# EAGLE design MainBoard 1.4.0 (EAGLE 9.5.0)
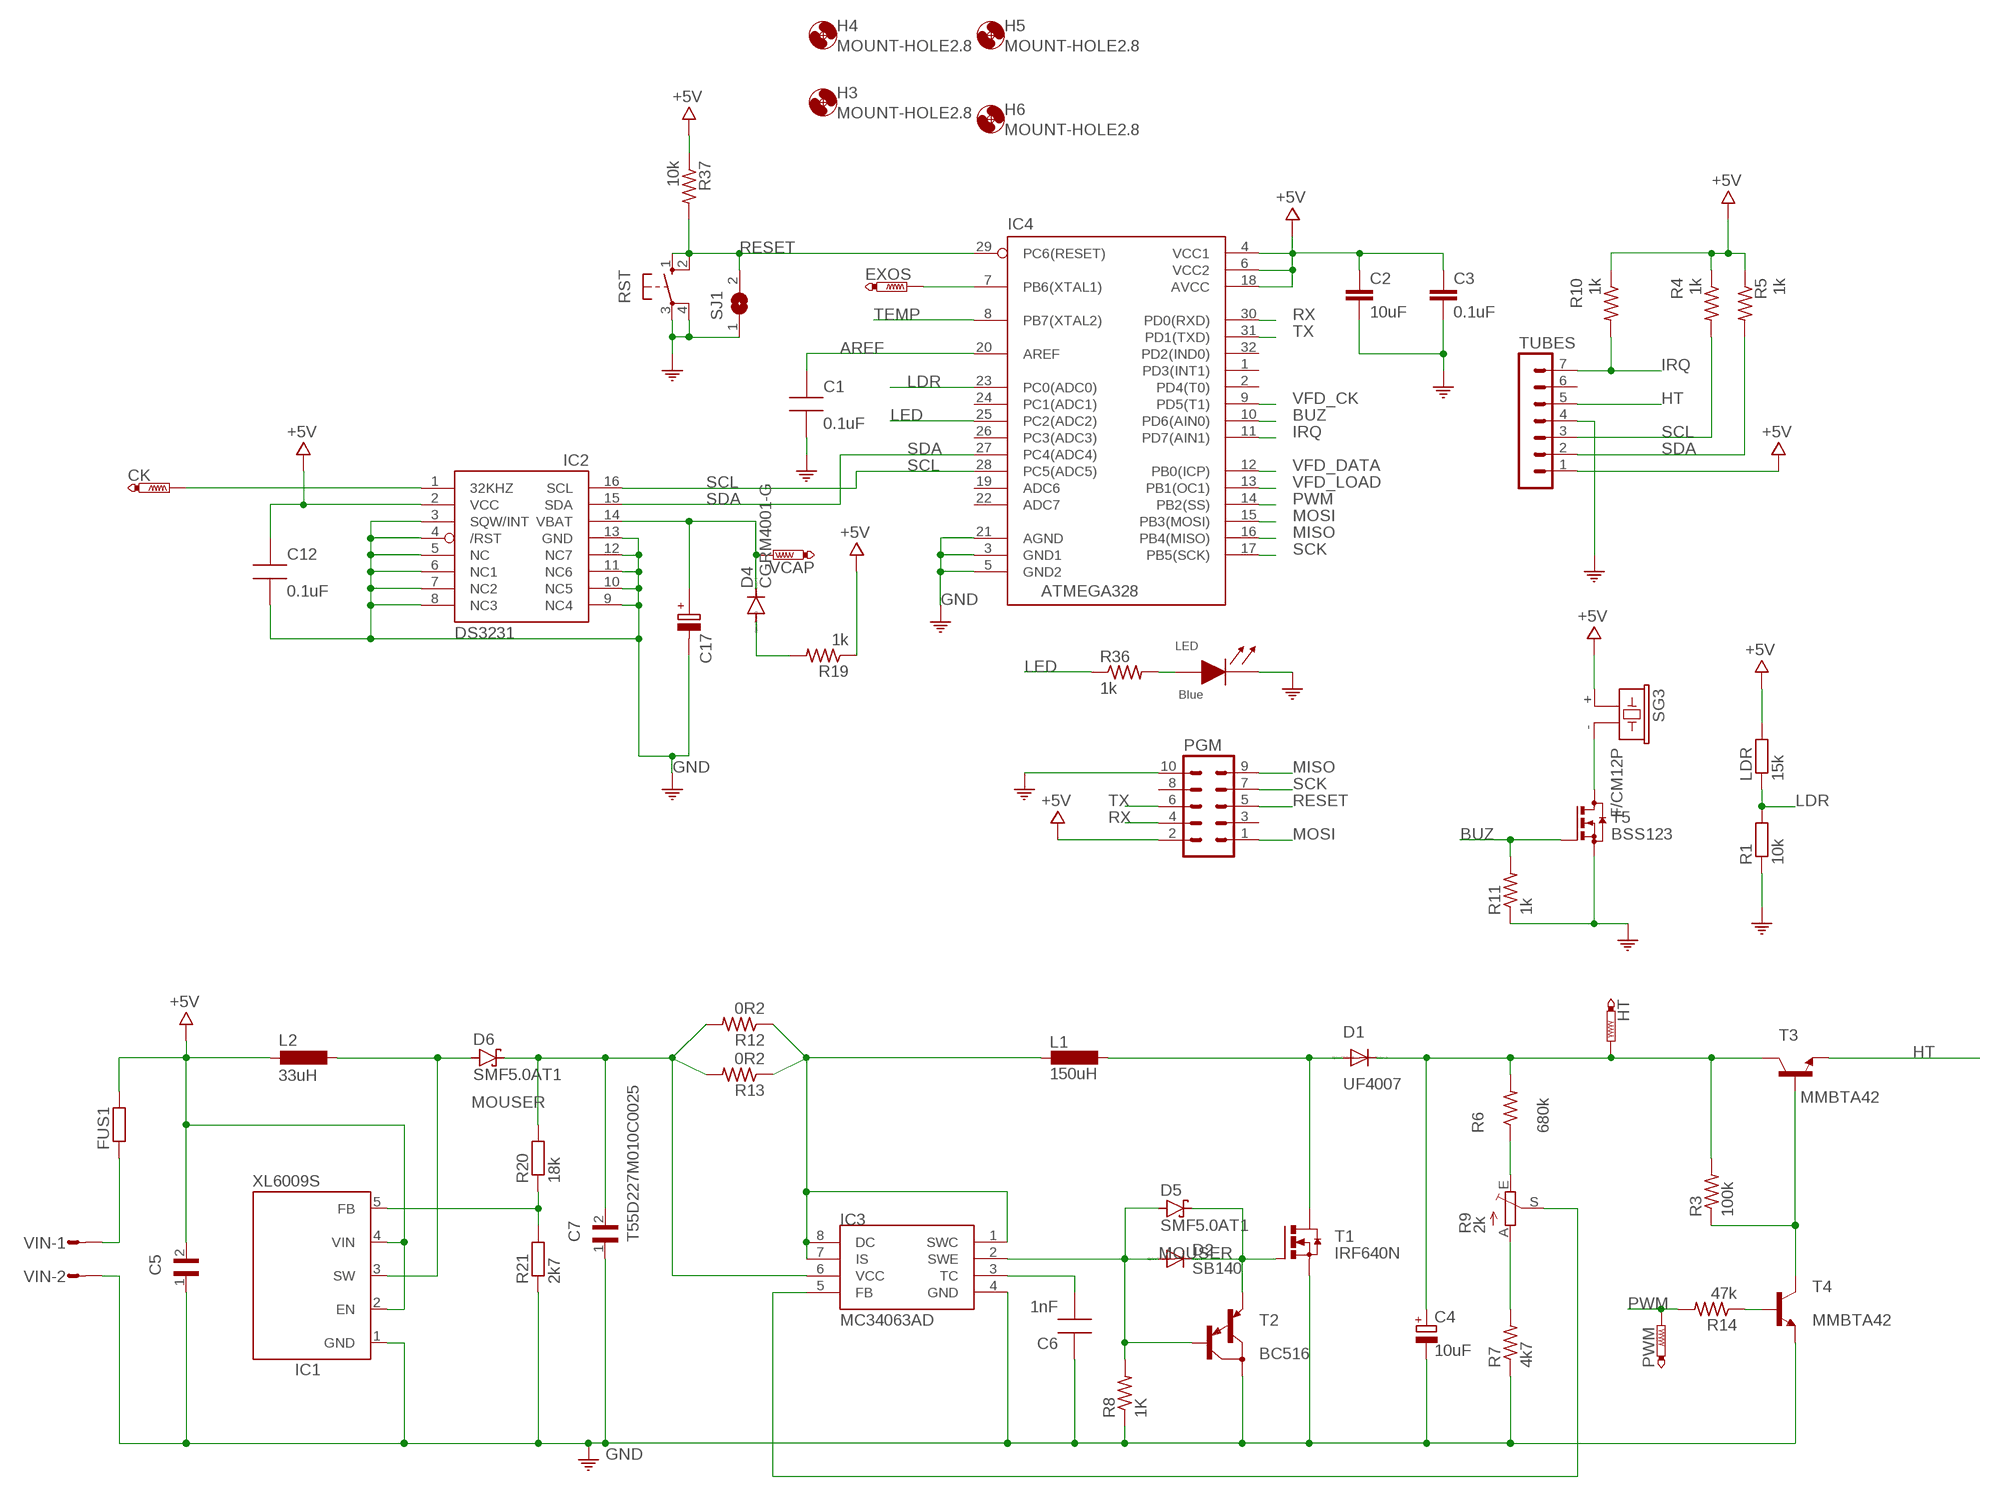
[diagram p0: schematic, sheet 1]

## Parts
C1  0.1uF  CAP0805-NP  [CAP0805-NP]
C2  10uF  C-EUC0603  [C0603]
C3  0.1uF  C-EUC0402K  [C0402K]
C4  10uF  CPOL-EUE3.5-10  [E3,5-10]
C5  T55D227M010C0025  [CAPPM7343X310N]
C6  1nF  CAP0805-NP  [CAP0805-NP]
C7  T55D227M010C0025  [CAPPM7343X310N]
C12  0.1uF  CAP0805-NP  [CAP0805-NP]
C17  AHG-35/100-RADIAL  [ELNA21.5X8.0]
CK  PTR1TP09R  [TP09R]
D1  UF4007  BYT01  [F126-10]
D2  SB140  DIODE-DO07  [DO07]
D4  CGRM4001-G  [SOD-123_MINI-SMA]
D5  SMF5.0AT1  [SOD123FL]
D6  SMF5.0AT1  [SOD123FL]
EXOS  PTR1TP09R  [TP09R]
FUS1  R-EU_R3225  [R3225]
H3  MOUNT-HOLE2.8  [2,8]
H4  MOUNT-HOLE2.8  [2,8]
H5  MOUNT-HOLE2.8  [2,8]
H6  MOUNT-HOLE2.8  [2,8]
HT  PTR1TP09R  [TP09R]
IC1  XL6009S  [TO263-5]
IC2  DS3231/SO  [SO16W]
IC3  MC34063AD  [SOIC8]
IC4  ATMEGA328  ATMEGA168-20AU  [QFP032]
L1  150uH  DO3316P  [DO3316P]
L2  33uH  MSS7341  [MSS7341]
LDR  15k  R-EU_0204/2V  [0204V]
LED  Blue  LED0805  [LED0805]
PGM  MA05-2  [MA05-2]
PWM  PTR1TP09R  [TP09R]
R1  10k  R-EU_M2012  [M2012]
R3  100k  R-US_R2012  [R2012]
R4  1k  R-US_M2012  [M2012]
R5  1k  R-US_M2012  [M2012]
R6  680k  R-US_R2012  [R2012]
R7  4k7  R-US_R2012  [R2012]
R8  1K  R-US_R2012  [R2012]
R9  2k  TRIM_EU-B25P  [B25P]
R10  1k  R-US_M2012  [M2012]
R11  1k  R-US_M2012  [M2012]
R12  0R2  R-US_R2010  [R2010]
R13  0R2  R-US_R2010  [R2010]
R14  47k  R-US_R2012  [R2012]
R19  1k  R-US_M2012  [M2012]
R20  18k  R-EU_R0805  [R0805]
R21  2k7  R-EU_R0805  [R0805]
R36  1k  R-US_M2012  [M2012]
R37  10k  R-US_M2012  [M2012]
RST  10-XX  [B3F-10XX]
SG3  F/CM12P  [F/CM12P]
SJ1  SJW  [SJW]
T1  IRF640N  IRF3704S  [D2PACK]
T2  BC516  [TO92]
T3  MMBTA42  BC846  [SOT23]
T4  MMBTA42  BC846  [SOT23]
T5  BSS123  [SOT23]
TUBES  MA07-1  [MA07-1]
VCAP  PTR1TP09R  [TP09R]
VIN  M02S  [02P]

## Nets
+5V [pwr]: C2.1 C3.1 C5.2 C12.1 FUS1.2 IC1.2(EN) IC1.4(VIN) IC2.2(VCC) IC4.4(VCC1) IC4.6(VCC2) IC4.18(AVCC) L2.1 LDR.2 PGM.2 R4.1 R5.1 R10.1 R19.1 R37.1 SG3.+ TUBES.1
AREF: C1.1 IC4.20(AREF)
BATT: C17.+ D4.C IC2.14(VBAT) VCAP.TP
BUZ: IC4.10(PD6(AIN0)) R11.2 T5.1(G)
GND: C1.2 C2.2 C3.2 C4.- C5.1 C6.1 C7.1 C12.2 C17.- IC1.1(GND) IC2.3(SQW/INT) IC2.4(/RST) IC2.5(NC) IC2.6(NC1) IC2.7(NC2) IC2.8(NC3) IC2.9(NC4) IC2.10(NC5) IC2.11(NC6) IC2.12(NC7) IC2.13(GND) IC3.4(GND) IC4.3(GND1) IC4.5(GND2) IC4.21(AGND) LED.1(CA) PGM.10 R1.1 R7.1 R8.1 R11.1 R21.1 RST.3(P) RST.4(P1) SJ1.1 T1.3(S) T2.3(C) T4.2(E) T5.2(S) TUBES.4 VIN.2 ; supply symbol labelled COM
HT: T3.2(E) TUBES.5
IRQ: IC4.11(PD7(AIN1)) R10.2 TUBES.7
LDR: IC4.23(PC0(ADC0)) LDR.1 R1.2
LED: IC4.25(PC2(ADC2)) R36.1
MISO: IC4.16(PB4(MISO)) PGM.9
MOSI: IC4.15(PB3(MOSI)) PGM.1
N$1: CK.TP IC2.1(32KHZ)
N$2: D1.A L1.2 T1.2(D)
N$3: SG3.- T5.3(D)
N$5: EXOS.TP IC4.7(PB6(XTAL1))
N$6: C6.2 IC3.3(TC)
N$7: R3.1 T3.1(B) T4.3(C)
N$8: IC1.5(FB) R20.1 R21.2
N$9: R7.2 R9.A
N$10: D2.A D5.A IC3.2(SWE) R8.2 T2.2(B)
N$11: R6.1 R9.E
N$14 [pwr]: FUS1.1 VIN.1
N$15: LED.2(AN) R36.2
N$16: IC3.5(FB) R9.S
N$17: IC3.1(SWC) IC3.7(IS) IC3.8(DC) L1.1 R12.1 R13.1
N$19: R14.1 T4.1(B)
N$21: D2.C D5.C T1.1(G) T2.1(E)
N$23: D4.A R19.2
N$25: D6.A IC1.3(SW) L2.2
PWM: IC4.14(PB2(SS)) PWM.TP R14.2
PWR [pwr]: C7.2 D6.C IC3.6(VCC) R12.2 R13.2 R20.2
RAW_HT: C4.+ D1.C HT.TP R3.2 R6.2 T3.3(C)
RESET: IC4.29(PC6(RESET)) PGM.5 R37.2 RST.1(S) RST.2(S1) SJ1.2
RX: IC4.30(PD0(RXD)) PGM.4
SCK: IC4.17(PB5(SCK)) PGM.7
SCL: IC2.16(SCL) IC4.28(PC5(ADC5)) R4.2 TUBES.3
SDA: IC2.15(SDA) IC4.27(PC4(ADC4)) R5.2 TUBES.2
TEMP: IC4.8(PB7(XTAL2))
TX: IC4.31(PD1(TXD)) PGM.6
VFD_CK: IC4.9(PD5(T1))
VFD_DATA: IC4.12(PB0(ICP))
VFD_LOAD: IC4.13(PB1(OC1))
Unconnected: IC4.1(PD3(INT1)) IC4.2(PD4(T0)) IC4.19(ADC6) IC4.22(ADC7) IC4.24(PC1(ADC1)) IC4.26(PC3(ADC3)) IC4.32(PD2(IND0)) PGM.3 PGM.8 TUBES.6

## Library data of the parts
C1 C6 C12 = MySMD:CAP0805-NP
C2 = rcl:C-EU: CAPACITOR, European symbol; MOUSER: 791-0603X106K100CT; SPICEPREFIX: C
C3 = rcl:C-EU: CAPACITOR, European symbol; MOUSER: 963-JMK042BJ104KC-W; SPICEPREFIX: C
C4 = resistor:CPOL-EU: POLARIZED CAPACITOR, European symbol
C5 = T55D227M010C0025:T55D227M010C0025: Cap Tant Polymer 220uF 10VDC D CASE 20% (7.3 X 4.3 X 2.8mm) SMD 7343-30 0.025 Ohm 105C T/R; DESCRIPTION: T55D227M010C0025; DIGI-KEY_PART_NUMBER: 718-2103-1-ND; DIGI-KEY_PURCHASE_URL: https://www.digikey.com/product-detail/en/vishay-sprague/T55D227M010C0025/718-2103-1-ND/5287349?utm_source=snapeda&utm_medium=aggregator&utm_campaign=symbol; MF: Vishay; MOUSER: T55D227M010C0025; MP: T55D227M010C0025; PACKAGE: 2917 Vishay
C7 = T55D227M010C0025:T55D227M010C0025: Cap Tant Polymer 220uF 10VDC D CASE 20% (7.3 X 4.3 X 2.8mm) SMD 7343-30 0.025 Ohm 105C T/R; DESCRIPTION: T55D227M010C0025; DIGI-KEY_PART_NUMBER: 718-2103-1-ND; DIGI-KEY_PURCHASE_URL: https://www.digikey.com/product-detail/en/vishay-sprague/T55D227M010C0025/718-2103-1-ND/5287349?utm_source=snapeda&utm_medium=aggregator&utm_campaign=symbol; MF: Vishay; MP: T55D227M010C0025; PACKAGE: 2917 Vishay
C17 = Elkos:AHG-35/100-RADIAL: AUDYN® - AHG Gepolt, radial High Grade AHG Gepolter Elekrolytkondensator für Audio-Netzteile, oder Verstärker im Home- und Car-Bereich. Technische Daten Anschlußdrähte: Kupfer, verzinnt AL: ? mm d2ø : ? mm Kapazitätsbereich: von 10 µF bis 2200 µF Nennspannungen: 25 V, 35 V, 50 V, 100 V C-Toleranz: 20 % ( bei 20° C ) Verlustfaktor: tan δ < 0,100 @ 1 kHz Temperaturbereich: - 40° C bis 85° C Verzerrung: sehr gering bei 10 kHz, 010 A - 120 dB oder niedriger gepolt AHG AUDYN® - AHG gepolt Bezeichnung C U DxH Rm Bestell.-Nr. U / Volt D x L/mm mm AHG/10.0/100V 10µF 100V 10x15 5,0 1341690 AHG/22.0/50V 22µF 50V 10x13 5,0 1341691 AHG/47.0/50V 47µF 50V 10x16 5,0 1341692 AHG/100.0/50V 100µF 50V 13x21 5,0 1341693 AHG/220.0/50V 220µF 50V 16x25 7,5 1341694 AHG/470.0/50V 470µF 50V 16x37 7,5 1341695 AHG/1000/35V 1000µF 35V 18x37 7,5 1341696 AHG/2200/35V 2200µF 35V 22x38 10,0 1341697 Alle Abmessungen in mm; MOUSER: 555-DB-5R5D474T
CK EXOS HT PWM VCAP = testpad:PTR1: TEST PIN
D1 = diode:BYT01: DIODE ultra fast
D2 = diode:DIODE-: DIODE
D4 = diode:CGRM400*-G: Molded plasitc,JEDEC SOD-123/Mini SMA Source: Comchip CGRM4001-G.pdf; MOUSER: 863-NSR0320MW2T1G
D5 D6 = diode:SMF5.0AT1: 200 W Transient Voltage Suppressor Source: Data sheet <http://www.onsemi.com/pub_link/Collateral/SMF5.0AT1-D.PDF>; MOUSER: 863-MBR0520LT1G
FUS1 = rcl:R-EU_: RESISTOR, European symbol; MOUSER: 530-0ZCG0150AF2C; SPICEPREFIX: R
H3-H6 = holes:MOUNT-HOLE: MOUNTING HOLE with drill center marker
IC1 = XL6009-TO263:XL6009: XL6009. 400KHz 60V 4A Switching Current Boost / Buck-Boost / Inverting DC/DC Converter. Created By: Manash Jyoti Deka. Github: https://github.com/mjdeka
IC2 = DS3231:DS3231: The DS3231 is a low-cost, extremely accurate I²C real-time clock (RTC) with an integrated temperature-compensated crystal oscillator (TCXO) and crystal. The device incorporates a battery input, and maintains accurate timekeeping when main power to the device is interrupted.; AVAILABILITY: Unavailable; MF: Maxim Integrated; MP: DS3231; PACKAGE: SOIC-16 Maxim Integrated; PRICE: None
IC3 = mc34063:MC34063
IC4 = MySMD:ATMEGA168-20AU
L1 = STEAM-inductor-coilcraft:DO3316P: COILCRAFT; OC_FARNELL: unknown; OC_NEWARK: unknown
L2 = STEAM-inductor-coilcraft:MSS7341: Shielded Power Inductors Package 6.6 × 6.6 mm x 4.1 mm high Source: http://www.farnell.com/datasheets/1681958.pdf; MOUSER: 710-784770330
LDR R1 R20 R21 = resistor:R-EU_: RESISTOR, European symbol
LED = MySMD:LED0805
PGM = con-lstb:MA05-2: PIN HEADER; OC_FARNELL: unknown; OC_NEWARK: unknown
R3-R8 R10-R14 R19 R36 R37 = adafruit:R-US_: RESISTOR, American symbol
R9 = pot:TRIM_EU-: POTENTIOMETER
RST = switch-omron:10-XX: OMRON SWITCH; MPN: B3F-1000; OC_FARNELL: 176432; OC_NEWARK: 36M3542
SG3 = buzzer:F/CM12P: BUZZER Source: Buerklin; OC_FARNELL: unknown; OC_NEWARK: unknown
SJ1 = jumper:SJ: SMD solder JUMPER
T1 = transistor-power:IRF3704: SMPS MOSFET HEXFET® Power MOSFET Source: http://www.irf.com/product-info/datasheets/data/irf3704.pdf
T2 = transistor-pnp:BC516: PNP Darlington Transistor
T3 T4 = transistor:BC846: NPN TRANSISTOR
T5 = transistor-small-signal:BSS123: N-CHANNEL MOS FET
TUBES = con-lstb:MA07-1: PIN HEADER; OC_FARNELL: unknown; OC_NEWARK: unknown
VIN = con-amp-quick:M02S: AMP QUICK CONNECTOR; OC_FARNELL: unknown; OC_NEWARK: unknown

## Module TUBEIN16
Ports: 

### Library data of the parts

## Net classes
0 default: width 0.254 mm, clearance 0.254 mm
1 pwr: width 0.254 mm, clearance 0.356 mm

## Board
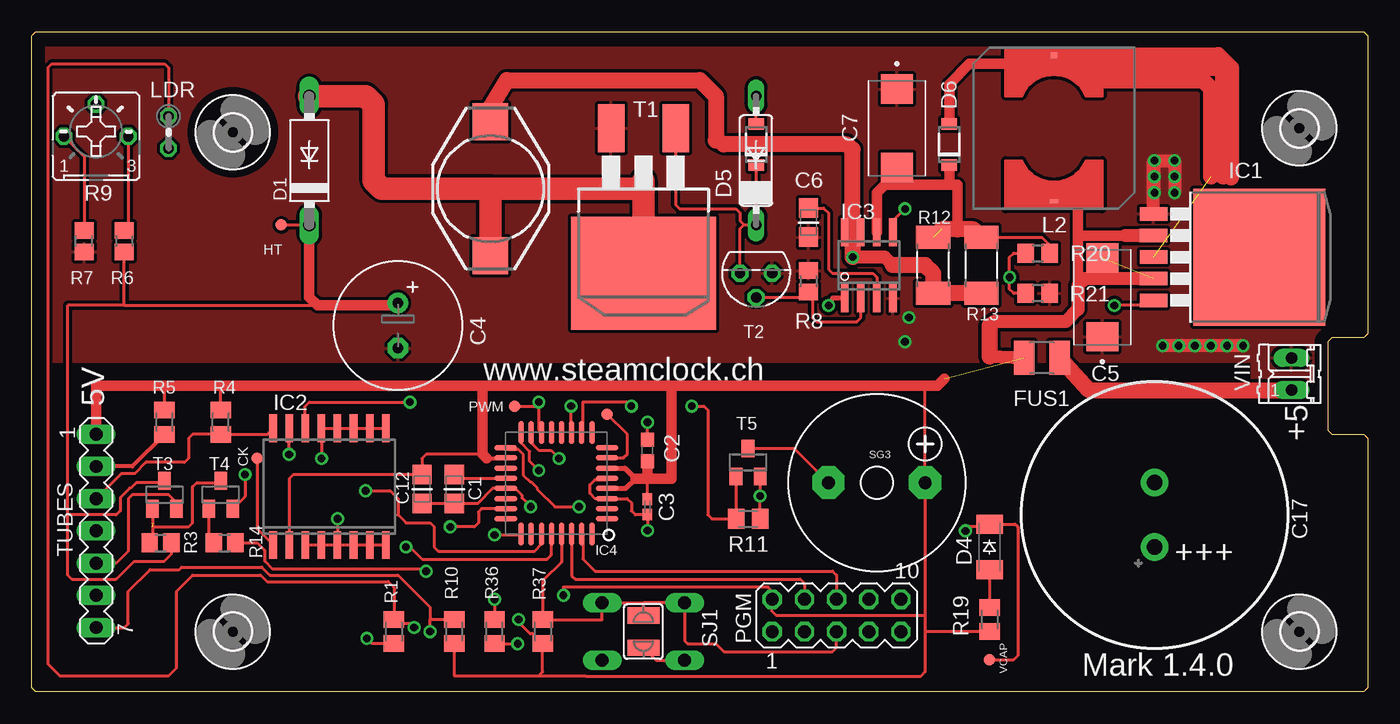
[diagram p1: board, top side]
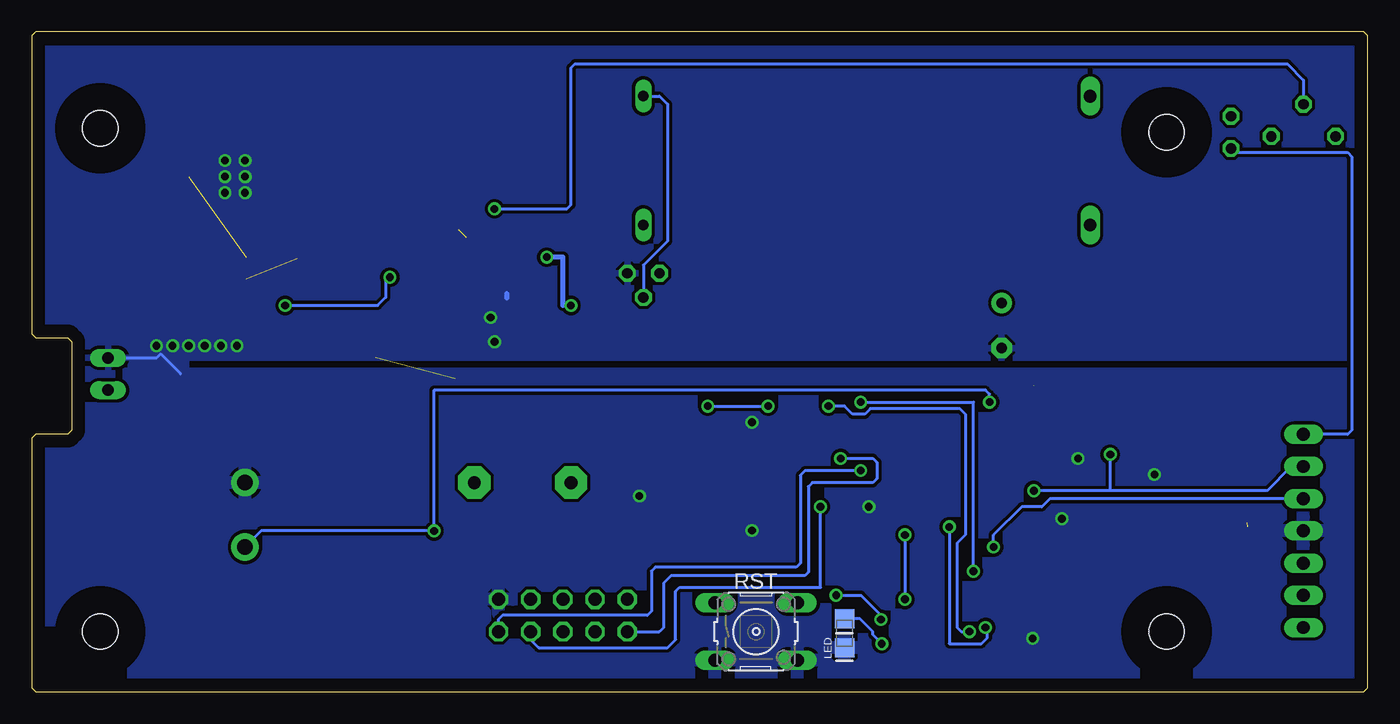
[diagram p2: board, bottom side, seen from below]

Size 105.41 x 52.07 mm. Coordinates in mm from the lower left corner, seen from the top.
Outline: 0.32,52.07 105.09,52.07 105.41,51.75 105.41,28.26 105.09,27.94 102.55,27.94 102.23,27.62 102.23,20.64 102.55,20.32 105.09,20.32 105.41,20 105.41,0.32 105.09,0 0.32,0 0,0.32 0,51.75 0.32,52.07
Copper layers (1*16): Top 0.035mm / dielectric 1.5mm / Bottom 0.035mm
Design rules "default": minimum track width 10mil, minimum drill 24mil, track to track 8mil, track to pad 8mil, pad to pad 8mil, via to via 8mil, smd to smd 8mil, copper to edge 40mil, drill to drill 8mil, minimum pad ring 10mil, minimum via ring 8mil, stop-mask expansion 4mil, vias tented up to drill 0mil, thermal gap 10mil

### Footprints (pad centres in the part's own frame; a part is rotated, then mirrored left to right if it is on the bottom)
CAP0805-NP = smd 1.524 x 1.524: 1 0,0; 2 2.286,0
C0603 = smd 1.1 x 1: 1 -0.85,0; 2 0.85,0
C0402K = smd 0.925 x 0.74: 1 -0.6,0; 2 0.6,0
E3,5-10 = drill 0.813 pad 1.6: + -1.778,0 | drill 0.813 pad 1.6 octagon: - 1.778,0
CAPPM7343X310N = smd 2.31 x 2.52: 1 -3.1,0; 2 3.1,0
ELNA21.5X8.0 = drill 1.2 pad 2.184: + -2.54,0; - 2.54,0
TP09R = smd 0.9 x 0.9: TP 0,0
F126-10 = drill 1.016 long: A 5.08,0; C -5.08,0
DO07 = drill 0.813 long: A 5.08,0; C -5.08,0
SOD-123_MINI-SMA = smd 1.5 x 2.1: A 1.8,0; C -1.8,0
SOD123FL = smd 0.91 x 1.22: A 1.625,0; C -1.625,0
R3225 = smd 1.6 x 2.7: 1 -1.4,0; 2 1.4,0
2,8 = hole 2.8: 0,0
TO263-5 = smd 1.067 x 2.159: 1 -3.404,-5.791; 2 -1.702,-5.791; 3 0,-5.791; 4 1.702,-5.791; 5 3.404,-5.791 | smd 10.8 x 10.41: 6 0,2.54
SO16W = smd 0.6 x 2.2: 1 -4.445,-4.6; 2 -3.175,-4.6; 3 -1.905,-4.6; 4 -0.635,-4.6; 5 0.635,-4.6; 6 1.905,-4.6; 7 3.175,-4.6; 8 4.445,-4.6; 9 4.445,4.6; 10 3.175,4.6; 11 1.905,4.6; 12 0.635,4.6; 13 -0.635,4.6; 14 -1.905,4.6; 15 -3.175,4.6; 16 -4.445,4.6
SOIC8 = smd 0.6 x 2.2: 1 -1.905,-2.6; 2 -0.635,-2.6; 3 0.635,-2.6; 4 1.905,-2.6; 5 1.905,2.6; 6 0.635,2.6; 7 -0.635,2.6; 8 -1.905,2.6
QFP032 = smd 0.432 x 1.778: 1 0,0; 2 0.8,0; 3 1.599,0; 4 2.399,0; 5 3.199,0; 6 3.998,0; 7 4.798,0; 8 5.598,0; 17 5.588,8.001; 18 4.798,7.997; 19 3.998,7.997; 20 3.199,7.997; 21 2.399,7.997; 22 1.599,7.997; 23 0.799,7.997; 24 0,7.997 | smd 1.778 x 0.432: 9 6.807,1.194; 10 6.807,2.007; 11 6.807,2.794; 12 6.807,3.607; 13 6.807,4.394; 14 6.807,5.182; 15 6.807,5.994; 16 6.816,6.803; 25 -1.194,6.807; 26 -1.194,5.994; 27 -1.194,5.182; 28 -1.194,4.394; 29 -1.194,3.607; 30 -1.194,2.794; 31 -1.194,2.007; 32 -1.194,1.194
DO3316P = smd 2.92 x 2.79: 1 -5.28,0; 2 5.28,0
MSS7341 = smd 0.61 x 0.305: 1 0,5.765 | smd 0.5 x 0.5: 2 0,-5.765
0204V = drill 0.813 octagon: 1 -1.27,0; 2 1.27,0
LED0805 = smd 1.524 x 1.524: 1 0,0; 2 2.286,0
MA05-2 = drill 1.016 octagon: 1 -5.08,-1.27; 2 -5.08,1.27; 3 -2.54,-1.27; 4 -2.54,1.27; 5 0,-1.27; 6 0,1.27; 7 2.54,-1.27; 8 2.54,1.27; 9 5.08,-1.27; 10 5.08,1.27
M2012 = smd 1.3 x 1.6: 1 -0.95,0; 2 0.95,0
R2012 = smd 1.3 x 1.5: 1 -0.85,0; 2 0.85,0
B25P = drill 0.813 octagon: A -2.54,0; E 2.54,0; S 0,2.54
R2010 = smd 1.8 x 2.7: 1 -2.2,0; 2 2.2,0
R0805 = smd 1.3 x 1.5: 1 -0.95,0; 2 0.95,0
B3F-10XX = drill 1.016 long: 1 -3.251,2.261; 2 3.251,2.261; 3 -3.251,-2.261; 4 3.251,-2.261
F/CM12P = drill 1.016 pad 2.54 octagon: + 3.81,0; - -3.81,0
SJW = smd 1.27 x 2.54: 1 -1.27,0; 2 1.27,0
D2PACK = smd 2.083 x 3.81: 1 -2.54,-8.89; 3 2.54,-8.89 | smd 11.43 x 8.89: 2 0,2.54
TO92 = drill 0.813 octagon: 1 1.27,0; 2 0,1.905; 3 -1.27,0
SOT23 = smd 1 x 1.4: 1 -0.95,-1.1; 2 0.95,-1.1; 3 0,1.1
MA07-1 = drill 1.016 long: 1 -7.62,0; 2 -5.08,0; 3 -2.54,0; 4 0,0; 5 2.54,0; 6 5.08,0; 7 7.62,0
02P = drill 0.914 long: 1 -1.27,0; 2 1.27,0

### Placement (x,y rotation side)
C1  33.34,17.15 270 top
C2  48.58,19.05 90 top
C3  48.58,14.6 270 top
C4  28.89,28.89 270 top
C5  84.45,31.12 90 top
C6  61.28,35.88 90 top
C7  68.26,44.45 270 top
C12  30.8,17.15 270 top
C17  88.58,13.97 90 top
CK  17.78,18.41 180 top
D1  21.91,41.91 90 top
D2  57.15,41.91 90 top
D4  75.56,11.43 270 top
D5  57.15,43.18 90 top
D6  72.39,43.18 90 top
EXOS  45.4,21.91 0 top
FUS1  79.69,26.35 180 top
H3  15.88,44.13 0 top
H4  15.88,4.76 0 top
H5  100.01,4.76 0 top
H6  100.01,44.45 0 top
HT  19.68,36.83 0 top
IC1  94.3,34.29 270 top
IC2  23.5,16.19 0 top
IC3  66.04,33.66 0 top
IC4  45.4,13.65 90 top
L1  36.2,39.69 270 top
L2  80.64,44.45 180 top
LDR  10.79,44.13 270 top
LED  41.27,3.49 90 bottom
PGM  63.5,6.03 0 top
PWM  38.1,22.54 0 top
R1  28.57,4.76 90 top
R3  10.16,11.75 0 top
R4  14.92,21.27 270 top
R5  10.48,21.27 270 top
R6  7.3,35.56 270 top
R7  4.13,35.56 90 top
R8  61.28,32.38 270 top
R9  5.08,43.81 0 top
R10  33.34,4.76 90 top
R11  56.52,13.65 180 top
R12  71.12,33.66 90 top
R13  74.93,33.66 90 top
R14  15.24,11.75 0 top
R19  75.56,5.71 90 top
R20  79.38,34.61 0 top
R21  79.38,31.43 180 top
R36  36.51,4.76 270 top
R37  40.32,4.76 90 top
RST  48.26,4.76 0 bottom
SG3  66.67,16.51 0 top
SJ1  48.26,4.76 90 top
T1  48.26,35.56 180 top
T2  57.15,33.02 180 top
T3  10.48,15.56 0 top
T4  14.92,15.56 0 top
T5  56.52,18.1 0 top
TUBES  5.08,12.7 270 top
VCAP  75.56,2.54 0 top
VIN  99.38,25.08 90 top

### Tracks (layer width: path | path; a pad name or v marks a point on that pad's centre or on a via)
+5V  (via drill 0.61)  (3 unrouted)
  Top 0.254: 37.37,18.41 IC4.18 | 40.01,1.27 40.32,1.59 R37.1 39.55,4.58 39.32,4.58 38.42,5.49 v38.42,5.71 | R5.1 10.48,24.13 | R4.1 14.92,24.13 | 40.01,1.27 33.34,1.27 R10.1 | R19.1 75.25,5.08 | 70.48,6.03 58.74,6.03 58.42,6.35 PGM.2 58.42,7.94 58.09,8.27 41.92,8.27 41.95,8.29 v41.95,7.62 | 26.35,24.13 | C3.1 48.58,16.83 | 35.56,18.73 31.11,18.73 30.8,18.41 C12.1 20.64,17.15 20.32,16.83 IC2.2 | 40.01,1.27 43.72,1.27 43.73,1.26 70.17,1.26 70.48,1.58 70.48,4.76 | R19.1 | 70.48,24.13 SG3.+ 70.48,6.03 | 70.48,6.03 70.48,4.76 | R19.1 70.49,4.77 70.48,4.76
  Top 0.305: 45.12,17.62 IC4.6 | 10.48,22.54 R5.1 | 35.88,18.41 37.37,18.41
  Top 0.406: IC4.6 46.8,17.65 47.62,16.83 46.85,16.05 IC4.4
  Top 0.813: 14.92,24.13 10.48,24.13 5.08,24.13 TUBES.1 | 14.92,24.13 26.35,24.13 | 26.35,24.13 35.56,24.13 | 50.48,24.13 35.56,24.13 | 47.62,16.83 48.58,16.83 | 48.58,16.83 50.48,16.83 50.48,24.13 | 35.56,24.13 35.56,18.73 35.88,18.41 | 48.58,16.83 C2.1 | 50.48,24.13 70.48,24.13 71.44,24.13 72,24.69 | L2.1 81.01,39.05 82.55,39.05 82.55,36.2 | 82.55,36.2 82.55,32.07 | 86.25,35.99 82.75,35.99 82.55,36.2
  Top 1.016: IC1.4 83.07,32.59 82.55,32.07 82.55,30.16 81.6,29.21 75.88,29.21 75.56,28.89 | 75.56,26.46 FUS1.2 | IC1.2 86.25,35.99
  Top 1.27: 75.56,28.89 75.56,26.46
  Bottom 0.254: v41.95,7.62 40.01,7.62 38.42,6.03 v38.42,5.71 | LDR.2 10.48,42.55 1.59,42.55 1.27,42.23 1.27,20.64 1.59,20.32 TUBES.1
AREF
  Top 0.254: C1.1 33.34,16.83 37.38,16.83
  Top 0.305: 37.38,16.83 IC4.20
BATT  (via drill 0.61)
  Top 0.254: VCAP.TP 77.47,2.54 77.79,2.86 77.79,13.02 77.58,13.23 D4.C 75.35,13.02 73.98,13.02 v73.66,12.7 | IC2.14 21.59,22.54 21.91,22.86 v29.84,22.86
  Bottom 0.254: C17.+ 87.31,12.7 v73.66,12.7 73.66,23.81 30.16,23.81 29.84,23.49 v29.84,22.86
BUZ  (via drill 0.61)
  Top 0.254: IC4.10 43.5,20.56 43.5,22.86 46.99,22.86 v47.31,22.54 | T5.1 R11.2 53.66,13.65 53.34,13.97 53.34,22.23 53.02,22.54 v52.07,22.54
  Bottom 0.254: v52.07,22.54 v47.31,22.54
GND  (via drill 0.61)
  Top 0.254: IC4.21 36.37,16.05 35.18,14.86 C1.2 C12.2 | R1.1 26.86,3.81 v26.45,4.22 | SJ1.1 49.25,2.5 RST.3 | 45.38,16.83 45.38,16.8 45.33,16.75 44.44,16.75 44.03,16.34 44.03,15.66 44.44,15.25 IC4.3 46.98,15.25 47.31,14.92 47.31,14.29 47.62,13.97 48.54,13.97 C3.2 v48.58,12.74 | C2.2 v48.58,21.27 | IC2.9 IC2.10 IC2.11 IC2.12 IC2.13 v22.86,18.41 | IC2.3 IC2.4 IC2.5 | IC2.5 IC2.6 IC2.7 IC2.8 | v24.13,13.65 IC2.5 | T4.2 16.83,15.41 v16.83,17.15 | T5.2 v57.47,15.45 R11.1 | 37.42,16.03 IC4.21 | v39.37,14.6 38.68,15.3 38.68,15.5 38.12,16.05 IC4.21
  Top 0.305: 45.38,16.83 IC4.5
  Top 1.016: v95.57,27.3 v89.22,27.3 | v88.58,39.37 v88.58,41.91 | v88.58,41.91 v90.17,41.91 v90.17,39.37 | IC1.1 88.51,41.83 v88.58,41.91
  Bottom 0.254: VIN.2 95.57,26.35 95.25,26.67 93.66,25.08
  Bottom 0.406: 67.94,31.43 IC3.4
  other vias: 88.58,40.64 90.17,40.64 90.49,27.3 91.76,27.3 93.03,27.3 94.3,27.3 68.9,27.62 69.22,29.53
  pour Bottom: -0.62,25.08 -0.91,-2.43 106.25,-0.64 105.97,25.08
  pour Top: 0,50.8 0,26.03 104.78,26.03 104.78,50.8
  pour Top: 105.41,27.3 96.2,27.3 96.2,24.45 105.41,24.45
  pour Bottom: 105.41,26.35 -0.64,26.35 -0.64,51.12 105.41,51.12
  pour Bottom: 106.05,27.62 106.05,22.54 99.06,22.54 99.06,27.62
  pour Bottom: 93.03,27.3 93.03,25.08 97.79,25.08 97.79,27.3
HT
  Top 0.254: T3.2 11.43,14.92 10.79,15.56 7.94,15.56 7.62,15.24 7.62,11.11 6.67,10.16 TUBES.5
IRQ  (via drill 0.61)
  Top 0.254: IC4.11 42.55,20.52 v42.55,22.54 | TUBES.7 7.3,5.08 7.62,5.4 7.62,7.94 9.34,9.65 11.64,9.65 11.83,9.84 18.14,9.84 18.78,9.21 28.89,9.21 31.43,6.67 31.43,5.71 | R10.2 31.43,5.71 | v31.43,4.76 31.43,5.71
  Bottom 0.254: v31.43,4.76 32.07,4.76 32.38,5.08 32.38,11.75 31.75,12.38 31.75,21.91 32.19,22.35 39.24,22.35 39.69,21.91 40.64,21.91 41.27,22.54 v42.55,22.54
LDR  (via drill 0.61)
  Top 0.254: IC4.23 35.49,14.45 35.24,14.2 35.24,13.33 34.92,13.02 v33.02,13.02 | v30.16,5.08 29.84,5.4 28.89,5.4 R1.2 28.57,8.26 28.13,8.7 18.57,8.7 18.06,9.21 12.7,9.21 11.43,7.94 11.43,1.91 10.79,1.27 2.22,1.27 1.27,2.22 1.27,49.21 1.59,49.53 10.48,49.53 10.79,49.21 LDR.1
  Bottom 0.254: v33.02,13.02 33.02,3.81 30.48,3.81 30.02,4.27 30.02,4.94 v30.16,5.08
LED  (via drill 0.61)
  Top 0.254: v36.51,7.3 R36.1 | v36.51,12.38 38.52,12.38 IC4.25
  Bottom 0.254: v36.51,12.38 v36.51,7.3
MISO  (via drill 0.61)
  Top 0.254: v40.01,17.46 39.28,18.18 39.28,18.95 38.6,19.64 IC4.16
  Bottom 0.254: v40.01,17.46 44.39,17.46 44.77,17.08 44.77,10.16 45.09,9.84 56.2,9.84 56.52,9.53 56.52,6.35 56.83,6.03 68.26,6.03 68.58,5.71 PGM.9
MOSI  (via drill 0.61)
  Top 0.254: IC4.15 39.41,19.66 39.56,19.51 39.56,19.49 40.01,19.05 40.96,19.05 v41.59,18.41
  Bottom 0.254: PGM.1 55.88,4.76 55.56,5.08 55.56,8.57 54.97,9.17 44.41,9.17 44.13,9.44 44.13,16.19 43.81,16.51 39.05,16.51 38.73,16.83 38.73,18.1 39.05,18.41 v41.59,18.41
N$1
  Top 0.254: CK.TP 17.78,12.86 IC2.1
N$2
  Top 1.778: L1.2 36.2,39.69 | 36.2,39.69 27.62,39.69 26.99,40.32 26.99,46.35 26.35,46.99 D1.A | 36.2,39.69 47.94,39.69 48.26,40.32 T1.2
N$3
  Top 0.254: SG3.- 60.18,19.2 T5.3
N$5
  Top 0.254: IC4.7 46.71,18.45 46.99,18.73 46.99,20.32 EXOS.TP
N$6
  Top 0.254: C6.2 62.48,38.16 62.87,37.78 62.87,33.34 63.18,33.02 66.36,33.02 66.67,32.7 IC3.3
N$7  (1 unrouted)
  Top 0.254: T4.3 14.92,16.51 13.02,16.51 12.7,16.19 12.7,13.33 12.38,13.02 9.53,13.02 | 9.53,13.33 T3.1 9.53,11.97 R3.1
N$8  (via drill 0.61)
  Top 0.254: IC1.5 88.1,30.48 v85.41,30.48 | R20.1 77.47,34.61 77.15,34.29 v77.15,32.7 77.15,31.75 77.47,31.43 R21.2
  Bottom 0.254: v85.41,30.48 78.11,30.48 77.47,31.12 77.47,32.38 v77.15,32.7
N$9
  Top 0.254: R9.A 4.13,42.23 R7.2
N$10
  Top 0.254: T2.2 60.86,31.12 R8.2 61.59,31.22 61.59,29.53 61.91,29.21 65.09,29.21 65.41,29.53 IC3.2 | D5.A D2.A
  Bottom 0.254: D2.A 55.88,46.99 55.24,46.35 55.24,35.56 57.15,33.66 T2.2
N$11
  Top 0.254: R9.E 7.62,36.73 R6.1
N$14
  Top 1.27: FUS1.1 83.42,23.81 VIN.1
N$15  (via drill 0.61)
  Top 0.254: R36.2 v38.34,3.81
  Bottom 0.254: v38.34,3.81 39.05,4.52 39.05,4.76 40.07,5.78 LED.2
N$16  (via drill 0.6)
  Top 0.254: IC3.5 67.94,37.15 v68.9,38.1
  Bottom 0.254: v68.9,38.1 63.18,38.1 62.87,38.42 62.87,49.21 62.55,49.53 6.35,49.53 5.08,48.26 R9.S
N$17  (via drill 0.6)
  Top 0.254: IC3.8 IC3.7 64.77,35.62 64.77,35.56
  Top 0.406: IC3.1 63.18,31.05 v62.87,30.48
  Top 0.61: IC3.8 64.77,36.51
  Top 1.016: 64.77,36.51 64.77,37.46 | 67.94,33.66 67.31,34.29 v64.77,34.29
  Top 1.27: 64.77,37.46 64.77,42.8 64.29,43.18 54.61,43.18 53.98,43.5 53.98,46.99 52.7,48.26 37.47,48.26 36.2,46.13 L1.1 | 67.94,33.66 70.48,33.66 71.12,33.02 R12.1 R13.1 | 64.77,35.56 v64.77,34.29
  Bottom 0.406: v62.87,30.48 63.5,30.48 63.5,34.29 v64.77,34.29
N$19
  Top 0.254: T4.1 13.97,12.17 R14.1
N$21
  Top 0.254: T2.1 55.88,36.51 56.2,36.83 | 56.2,36.83 D2.C D5.C | T1.1 50.8,38.42 51.12,38.1 55.56,38.1 55.88,37.78 55.88,37.15 56.2,36.83
N$23
  Top 0.254: D4.A R19.2
N$25  (1 unrouted)
  Top 0.813: 72.43,44.77 D6.A 72.39,47.94 73.98,49.53 79.96,49.53 L2.2
  Top 1.27: L2.2 81.86,50.21 | 81.86,50.21 93.61,50.21 94.61,49.21 94.61,40.58 | 81.86,50.21 83.34,48.74 | 83.34,48.74 83.82,48.26 92.39,48.26 93.03,47.62 93.03,40.64 | 83.34,48.74 83.82,49.21 93.66,49.21 93.98,48.89 93.98,40.64
PWM  (via drill 0.61)
  Top 0.254: v40.01,22.86 40.01,22.54 | 40.01,22.54 40.01,20.68 IC4.14 | PWM.TP 40.01,22.54 | v31.11,9.53 30.92,9.72 18.99,9.72 18.37,10.33 18.37,11.16 17.78,11.75 R14.2
  Bottom 0.254: v31.11,9.53 31.11,22.86 v40.01,22.86
PWR  (1 unrouted)
  Top 0.254: C7.2 68.26,40 | R13.2 79.72,35.85 80.33,35.24 R20.2
  Top 0.813: 73.03,36.49 73.03,40 72.39,40 | IC3.6 66.67,39.37 67.31,40 68.26,40 72.39,40 | D6.C 72.39,40
  Top 1.27: 71.75,36.49 73.03,36.49 74.3,36.49 R13.2
RAW_HT
  Top 0.254: C4.+ 28.87,30.48 | 7.3,30.48 22.54,30.48 | 7.3,30.48 R6.2 | 7.3,30.48 2.86,30.48 2.86,13.97 | 2.86,13.97 2.86,9.21 3.17,8.89 6.67,8.89 8.08,10.3 10.44,10.3 11.01,10.87 R3.2 | T3.3 10.33,16.51 8.26,16.51 7.81,16.07 7.73,16.07 6.99,15.32 6.99,14.29 6.67,13.97 2.86,13.97 | HT.TP D1.C
  Top 0.813: 28.87,30.48 22.54,30.48 21.91,31.12 D1.C
RESET
  Top 0.254: IC4.29 41.8,10.24 40.32,8.76 R37.2 45.01,5.71 RST.2 48.26,7.02 | PGM.5 63.5,3.49 63.18,3.18 54.61,3.18 53.98,3.81 51.75,3.81 51.51,4.05 RST.1 48.26,7.02 | SJ1.2 48.26,7.02
RX
  Top 0.254: IC4.30 42.61,9.14 42.86,8.89 60.64,8.89 60.96,8.57 PGM.4
SCK  (via drill 0.61)
  Top 0.254: IC4.17 37.49,19.15 38.37,19.15 38.78,18.74 38.78,17.1 39.32,16.56 39.4,16.56 39.88,16.09 39.88,16 41.27,14.6 v43.18,14.6
  Bottom 0.254: v43.18,14.6 43.18,8.26 54.29,8.26 54.61,7.94 54.61,4.13 55.24,3.49 65.41,3.49 66.04,4.13 PGM.7
SCL  (via drill 0.61)
  Top 0.254: TUBES.3 7.09,17.25 8.16,17.25 9.01,18.1 12.06,18.1 12.38,18.41 12.38,20 12.7,20.32 R4.2 18.58,20.32 IC2.16 | v29.53,11.43 29.84,11.43 30.8,10.48 40.64,10.48 40.96,10.79 41.01,10.79 IC4.28
  Bottom 0.254: TUBES.3 25.08,15.24 25.72,14.6 27.3,14.6 29.53,12.38 v29.53,11.43
SDA  (via drill 0.61)
  Top 0.254: IC4.27 40.32,12.36 40.32,11.75 39.69,11.11 32.07,11.11 31.75,11.43 31.75,13.02 31.43,13.33 29.53,13.33 28.89,13.97 28.89,15.24 28.26,15.88 v26.35,15.88 | v20.32,18.73 IC2.15
  Top 0.305: R5.2 7.93,17.78 TUBES.2
  Bottom 0.254: TUBES.2 6.03,17.78 7.94,15.88 20.32,15.88 | 20.32,15.88 v26.35,15.88 | 20.32,15.88 v20.32,18.73
TX
  Top 0.254: IC4.31 43.5,12.36 43.5,10.48 44.45,9.53 63.18,9.53 63.5,9.21 PGM.6

### Text on the board
tNames: www.steamclock.ch | 5V | 5 | + | + | + | + | Mark 1.4.0